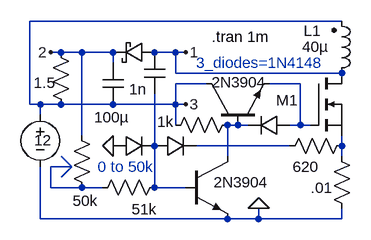
[diagram p0: schematic cur-mode-buck-boost-12609.asc]
cur-mode-buck-boost-12609.asc, the LTspice schematic file:
Version 4
SHEET 1 1624 1340
WIRE 400 -256 -80 -256
WIRE -32 -208 -48 -208
WIRE 0 -208 -32 -208
WIRE 48 -208 0 -208
WIRE 144 -208 112 -208
WIRE 160 -208 144 -208
WIRE 48 -192 48 -208
WIRE 144 -176 144 -208
WIRE 400 -176 144 -176
WIRE 192 -160 144 -160
WIRE 336 -160 288 -160
WIRE -80 -128 -80 -256
WIRE -64 -128 -80 -128
WIRE -32 -128 -64 -128
WIRE 48 -128 -32 -128
WIRE 144 -128 144 -160
WIRE 144 -128 48 -128
WIRE 160 -128 144 -128
WIRE -64 -112 -64 -128
WIRE 144 -96 144 -128
WIRE 240 -96 224 -96
WIRE 256 -96 240 -96
WIRE 336 -96 336 -160
WIRE 336 -96 320 -96
WIRE 352 -96 336 -96
WIRE 0 -80 0 -208
WIRE 112 -64 112 -144
WIRE 320 -64 176 -64
WIRE 400 -64 400 -80
WIRE 224 -48 224 -96
WIRE 400 -48 400 -64
WIRE -16 -32 -48 -32
WIRE -48 0 -48 -32
WIRE 0 0 -48 0
WIRE 32 0 0 0
WIRE 112 0 112 -64
WIRE 160 0 112 0
WIRE -64 48 -64 -32
WIRE 224 48 -64 48
WIRE 272 48 272 32
WIRE 272 48 224 48
WIRE 400 48 400 32
WIRE 400 48 272 48
FLAG 272 32 0
FLAG 160 -208 1
FLAG -48 -208 2
FLAG 160 -128 3
FLAG 48 -64 0
SYMBOL ind2 384 -160 M180
WINDOW 0 -43 81 Left 0
WINDOW 3 -45 57 Left 0
SYMATTR InstName L1
SYMATTR Value 40µ
SYMATTR SpiceLine Rser=.01
SYMBOL voltage -64 -128 R0
WINDOW 3 4 71 Bottom 0
WINDOW 123 -32 56 VBottom 0
WINDOW 0 -7 59 Invisible 0
SYMATTR Value 12
SYMATTR InstName V1
SYMATTR SpiceLine Rser=.01
SYMBOL res 16 16 R180
WINDOW 0 36 76 Invisible 0
WINDOW 3 -9 -4 Left 0
SYMATTR InstName R14
SYMATTR Value 50k
SYMBOL res 416 48 R180
WINDOW 0 36 76 Invisible 0
WINDOW 3 30 48 Left 0
SYMATTR InstName R1
SYMATTR Value .01
SYMBOL cap 96 -208 R0
WINDOW 0 -56 78 Invisible 0
WINDOW 3 -10 41 Top 0
SYMATTR InstName C2
SYMATTR Value 1n
SYMBOL res 128 -80 R270
WINDOW 0 32 56 Invisible 0
WINDOW 3 37 1 VBottom 0
SYMATTR InstName R5
SYMATTR Value 1k
SYMBOL diode 112 -80 M90
WINDOW 0 0 32 Invisible 0
WINDOW 3 32 32 Invisible 0
SYMATTR InstName D1
SYMATTR Value 1N4148
SYMATTR Description Schottky diode
SYMATTR Type schottky
SYMBOL nmos 352 -176 R0
WINDOW 0 -53 42 Left 0
WINDOW 3 56 72 Invisible 0
SYMATTR InstName M1
SYMATTR Value FDR4420A
SYMBOL schottky 112 -224 R90
WINDOW 0 0 32 Invisible 0
WINDOW 3 32 32 Invisible 0
SYMATTR InstName D2
SYMATTR Value MBRB2545CT
SYMBOL cap 32 -192 R0
WINDOW 0 -56 78 Invisible 0
WINDOW 3 14 68 Top 0
SYMATTR InstName C1
SYMATTR Value 100µ
SYMBOL res -16 -112 R180
WINDOW 0 36 76 Invisible 0
WINDOW 3 24 49 Left 0
SYMATTR InstName R2
SYMATTR Value 1.5
SYMBOL diode 320 -112 R90
WINDOW 0 0 32 Invisible 0
WINDOW 3 32 32 Invisible 0
SYMATTR InstName D3
SYMATTR Value 1N4148
SYMATTR Description Schottky diode
SYMATTR Type schottky
SYMBOL res 16 16 R270
WINDOW 0 32 56 Invisible 0
WINDOW 3 -2 80 VBottom 0
SYMATTR InstName R4
SYMATTR Value 51k
SYMBOL diode 48 -80 M90
WINDOW 0 0 32 Invisible 0
WINDOW 3 32 32 Invisible 0
SYMATTR InstName D4
SYMATTR Value 1N4148
SYMATTR Description Schottky diode
SYMATTR Type schottky
SYMBOL res 304 -48 R270
WINDOW 0 32 56 Invisible 0
WINDOW 3 0 41 VBottom 0
SYMATTR InstName R3
SYMATTR Value 620
SYMBOL npn2 160 -48 R0
WINDOW 0 56 32 Invisible 0
WINDOW 3 43 40 Left 0
SYMATTR InstName Q3
SYMATTR Value 2N3904
SYMBOL npn2 192 -96 R270
WINDOW 0 56 32 Invisible 0
WINDOW 3 66 8 VRight 0
SYMATTR InstName Q1
SYMATTR Value 2N3904
TEXT 200 -232 Left 0 !.tran 1m
TEXT 24 -32 Left 0 ;0 to 50k
TEXT 176 -192 Left 0 ;3_diodes=1N4148
LINE Normal -32 -48 -16 -32
LINE Normal -32 -16 -16 -32

The netlist it stands for:
* cur-mode-buck-boost-12609.asc
L1 1 3 40µ Rser=.01
V1 3 0 12 Rser=.01
R14 N006 2 50k
R1 0 N005 .01
C2 1 N003 1n
R5 3 N002 1k
D1 N003 N004 1N4148
M1 1 N001 N005 N005 FDR4420A
D2 1 2 MBRB2545CT
C1 2 3 100µ
R2 3 2 1.5
D3 N001 N002 1N4148
R4 N006 N003 51k
D4 0 N003 1N4148
R3 N004 N005 620
Q3 N002 N003 0 0 2N3904
Q1 3 N002 N001 0 2N3904
.model D D
.lib standard.dio
.model NPN NPN
.model PNP PNP
.lib standard.bjt
.model NMOS NMOS
.model PMOS PMOS
.lib standard.mos
.tran 1m
* 0 to 50k
* 3_diodes=1N4148
.backanno
.end